# Altium project NGI_Search_StepDown.PrjPcb
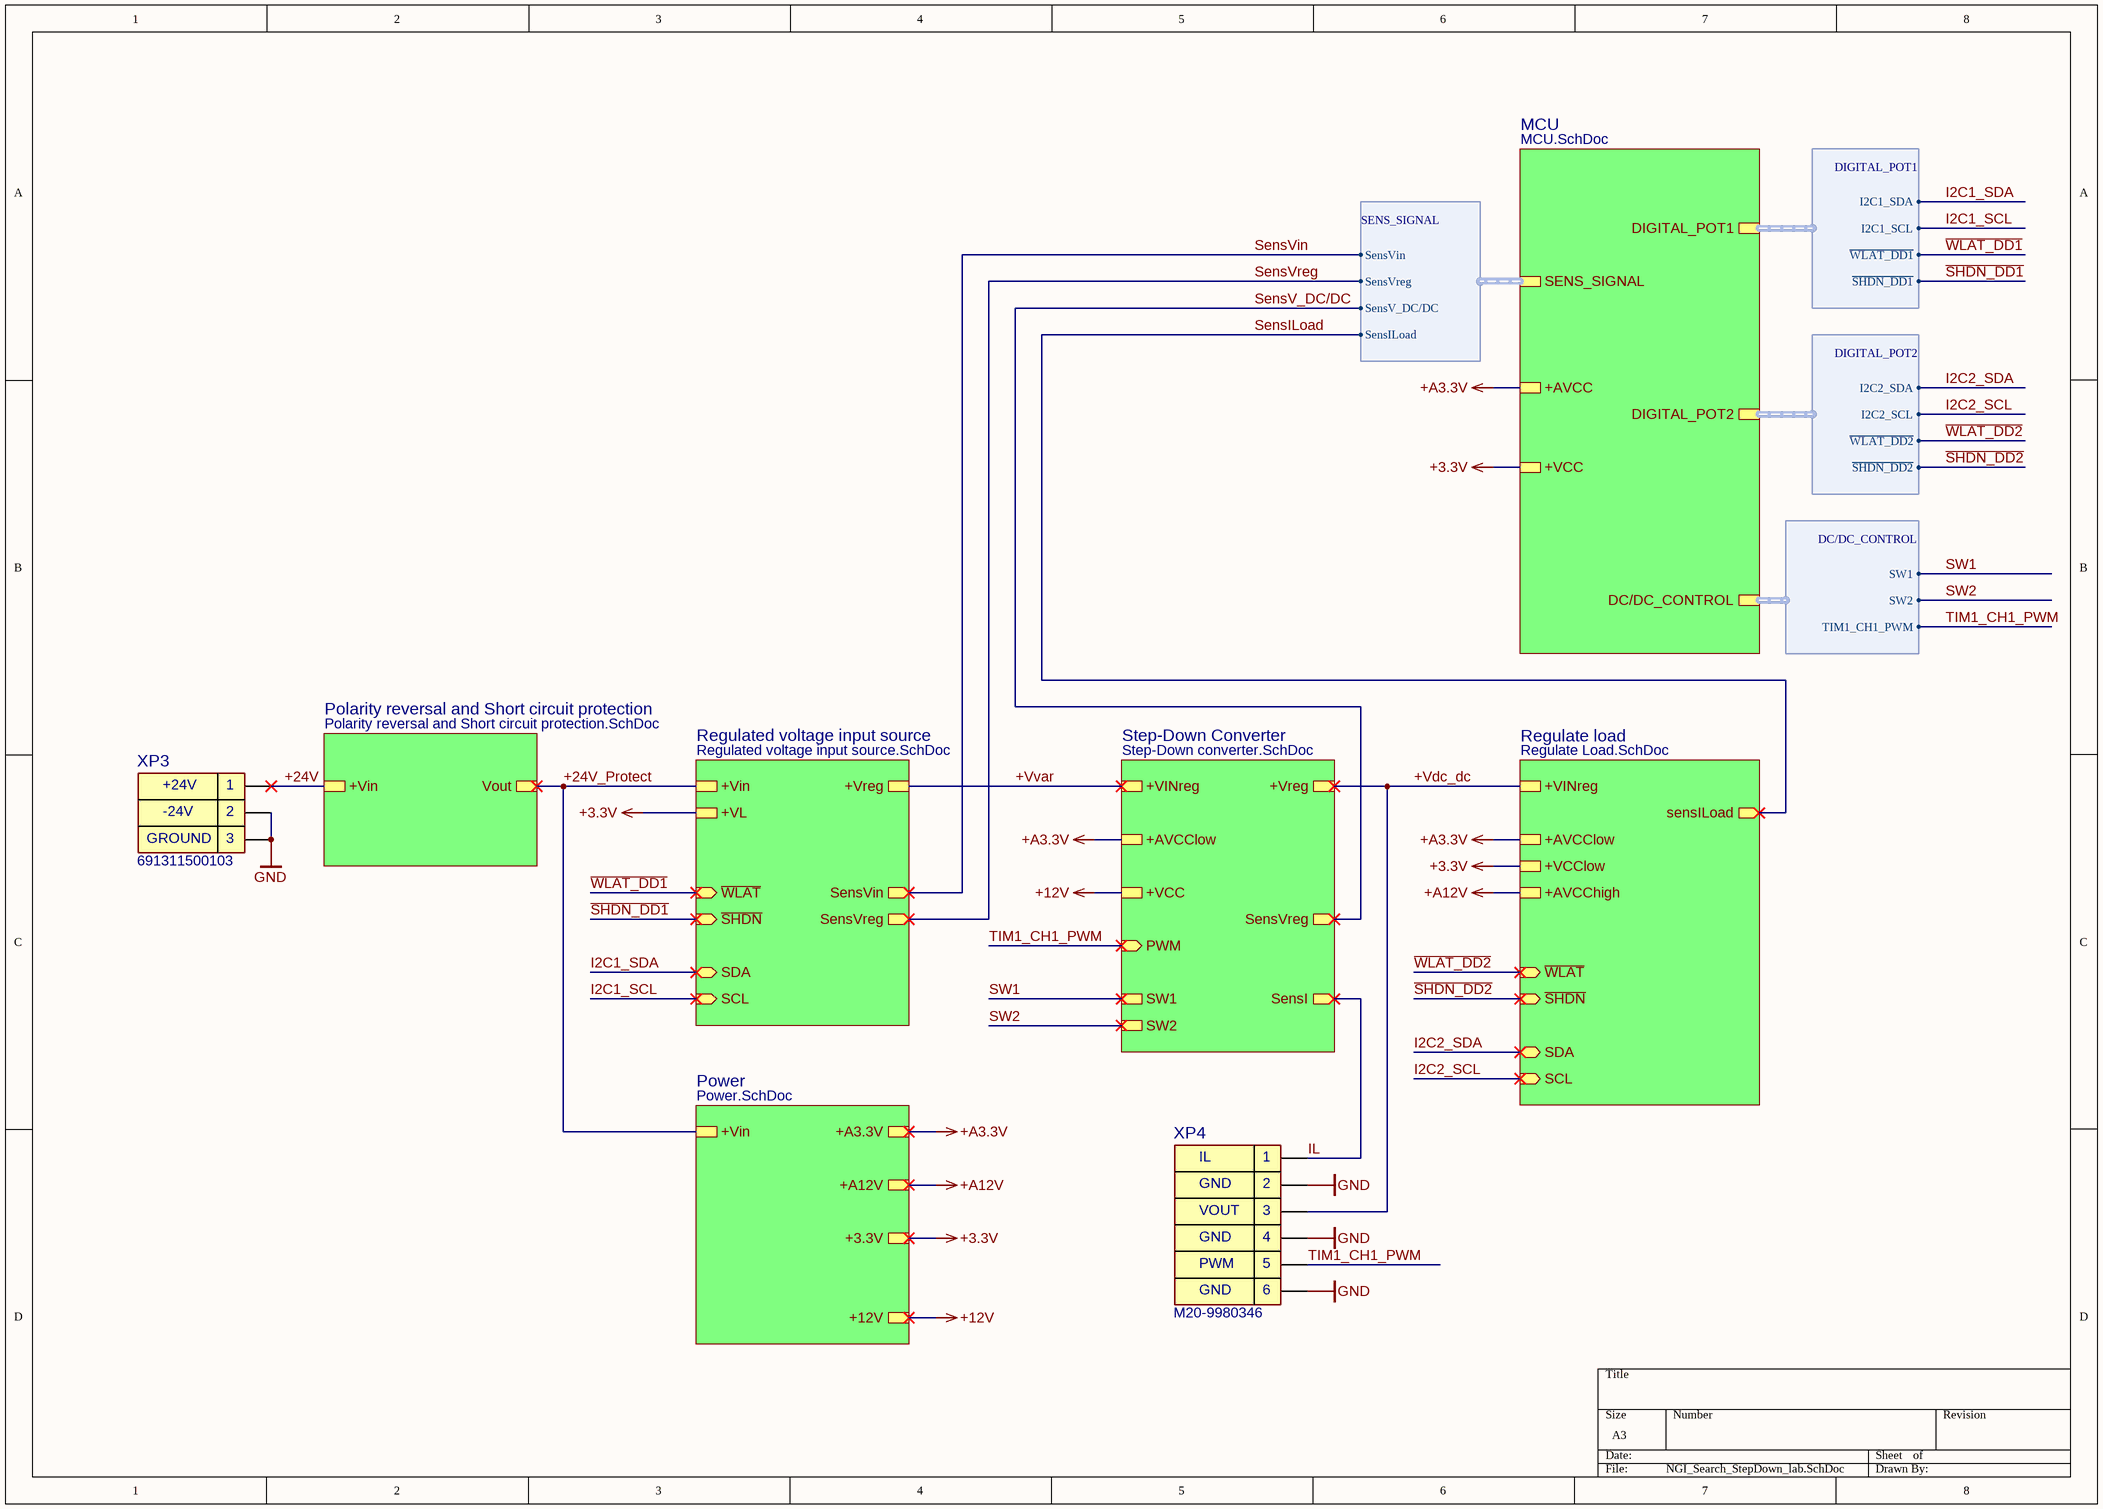
[diagram p0: NGI_Search_StepDown_lab.SchDoc]
5 sheets, 97 parts. Net scope: hierarchical (ports join the sheet entries above them; power ports are global).
Board file: NGIStepDownPCB.PcbDoc
Sheets:
  NGI_Search_StepDown_lab.SchDoc
    Step-Down Converter = Step-Down converter.SchDoc
    Regulated voltage input source = Regulated voltage input source.SchDoc
    Regulate load = Regulate Load.SchDoc
    Power = Power.SchDoc

## Sheet NGI_Search_StepDown_lab.SchDoc
size A3; SheetNumber: 1; SheetTotal: 7

### Parts
XP3  691311500103  [691311500103]
XP4  M20-9980346  [M20-9980346]

### Sub-sheets
MCU = MCU.SchDoc (file not in this document): DIGITAL_POT1 (harness DIGITAL_POT1), DIGITAL_POT2 (harness DIGITAL_POT2), DC/DC_CONTROL (harness DC/DC_CONTROL), SENS_SIGNAL (harness SENS_SIGNAL), +AVCC, +VCC
Polarity reversal and Short circuit protection = Polarity reversal and Short circuit protection.SchDoc (file not in this document): +Vin, Vout
Power = Power.SchDoc: +A12V, +A3.3V, +3.3V, +12V, +Vin
Regulate load = Regulate Load.SchDoc: +AVCClow, +VCClow, SCL (in), SDA (bidir), ~{WLAT} (in), ~{SHDN} (in), +AVCChigh, +VINreg, sensILoad (out)
Regulated voltage input source = Regulated voltage input source.SchDoc: +Vin, +Vreg, SCL (in), SDA (bidir), ~{WLAT} (in), ~{SHDN} (in), SensVin (out), SensVreg (out), +VL
Step-Down Converter = Step-Down converter.SchDoc: +VINreg, PWM (in), +VCC, +AVCClow, SensI (out), SW1, SW2, +Vreg, SensVreg (out)

### Harnesses
SENS_SIGNAL: SensVin, SensVreg, SensV_DC/DC, SensILoad
DIGITAL_POT1: I2C1_SDA, I2C1_SCL, ~{WLAT_DD1}, ~{SHDN_DD1}
DIGITAL_POT2: I2C2_SDA, I2C2_SCL, ~{WLAT_DD2}, ~{SHDN_DD2}
DC/DC_CONTROL: SW1, SW2, TIM1_CH1_PWM

### Nets
+3.3V: sheet Regulated voltage input source/+VL, sheet Regulate load/+VCClow, sheet Power/+3.3V, sheet MCU/+VCC
+12V: sheet Step-Down Converter/+VCC, sheet Power/+12V
+A3.3V: sheet Step-Down Converter/+AVCClow, sheet Regulate load/+AVCClow, sheet Power/+A3.3V, sheet MCU/+AVCC
+A12V: sheet Regulate load/+AVCChigh, sheet Power/+A12V
GND: XP3.2 XP3.3 XP4.2 XP4.4 XP4.6
+24V: XP3.1 ; sheet Polarity reversal and Short circuit protection/+Vin
+24V_Protect: sheet Regulated voltage input source/+Vin, sheet Power/+Vin, sheet Polarity reversal and Short circuit protection/Vout
+Vdc_dc: XP4.3 ; sheet Step-Down Converter/+Vreg, sheet Regulate load/+VINreg
+Vvar: sheet Step-Down Converter/+VINreg, sheet Regulated voltage input source/+Vreg
I2C1_SCL: sheet Regulated voltage input source/SCL, sheet MCU/DIGITAL_POT1.I2C1_SCL
I2C1_SDA: sheet Regulated voltage input source/SDA, sheet MCU/DIGITAL_POT1.I2C1_SDA
I2C2_SCL: sheet Regulate load/SCL, sheet MCU/DIGITAL_POT2.I2C2_SCL
I2C2_SDA: sheet Regulate load/SDA, sheet MCU/DIGITAL_POT2.I2C2_SDA
IL: XP4.1 ; sheet Step-Down Converter/SensI
~{SHDN_DD1}: sheet Regulated voltage input source/~{SHDN}, sheet MCU/DIGITAL_POT1.~{SHDN_DD1}
~{SHDN_DD2}: sheet Regulate load/~{SHDN}, sheet MCU/DIGITAL_POT2.~{SHDN_DD2}
SensILoad: sheet Regulate load/sensILoad, sheet MCU/SENS_SIGNAL.SensILoad
SensV_DC/DC: sheet Step-Down Converter/SensVreg, sheet MCU/SENS_SIGNAL.SensV_DC/DC
SensVin: sheet Regulated voltage input source/SensVin, sheet MCU/SENS_SIGNAL.SensVin
SensVreg: sheet Regulated voltage input source/SensVreg, sheet MCU/SENS_SIGNAL.SensVreg
SW1: sheet Step-Down Converter/SW1, sheet MCU/DC/DC_CONTROL.SW1
SW2: sheet Step-Down Converter/SW2, sheet MCU/DC/DC_CONTROL.SW2
TIM1_CH1_PWM: XP4.5 ; sheet Step-Down Converter/PWM, sheet MCU/DC/DC_CONTROL.TIM1_CH1_PWM
~{WLAT_DD1}: sheet Regulated voltage input source/~{WLAT}, sheet MCU/DIGITAL_POT1.~{WLAT_DD1}
~{WLAT_DD2}: sheet Regulate load/~{WLAT}, sheet MCU/DIGITAL_POT2.~{WLAT_DD2}

### Notes on the sheet
- (near XP3) +24V
- GROUND
- (near XP3) -24V
- IL
- GND
- (near XP4) VOUT
- PWM

### Library data of the parts
XP3 = 691311500103: Pluggable Terminal Blocks WR-TBL 300VAC 20A 3P Vertical; Manufacturer: Wurth Elektronik; Case: 3 VERTICAL PIN Pitch: 5.08 mm; Datasheet Link: https://www.we-online.com/components/products/datasheet/691311500103.pdf; ManufacturerPartNumber: 691311500103; Mouser Part Number: 710-691311500103; Mouser Price/Stock: https://eu.mouser.com/ProductDetail/Wurth-Elektronik/691311500103?qs=2kOmHSv6VfTr95JPv5RlIw%3D%3D
XP4 = M20-9980346: Headers & Wire Housings 03+03 DIL VERTICAL PIN HEADER TIN; Manufacturer: Harwin; Case: 03+03 DIL VERTICAL PIN; Datasheet Link: https://eu.mouser.com/datasheet/2/181/M20-998-1220570.pdf; ManufacturerPartNumber: M20-9980346; Mouser Part Number: 855-M20-9980346; Mouser Price/Stock: https://eu.mouser.com/ProductDetail/Harwin/M20-9980346?qs=%252Bk6%2F5FB6qrmHk2P20oz3FA%3D%3D

## Sheet Step-Down converter.SchDoc
size A3; SheetNumber: 3; SheetTotal: 7
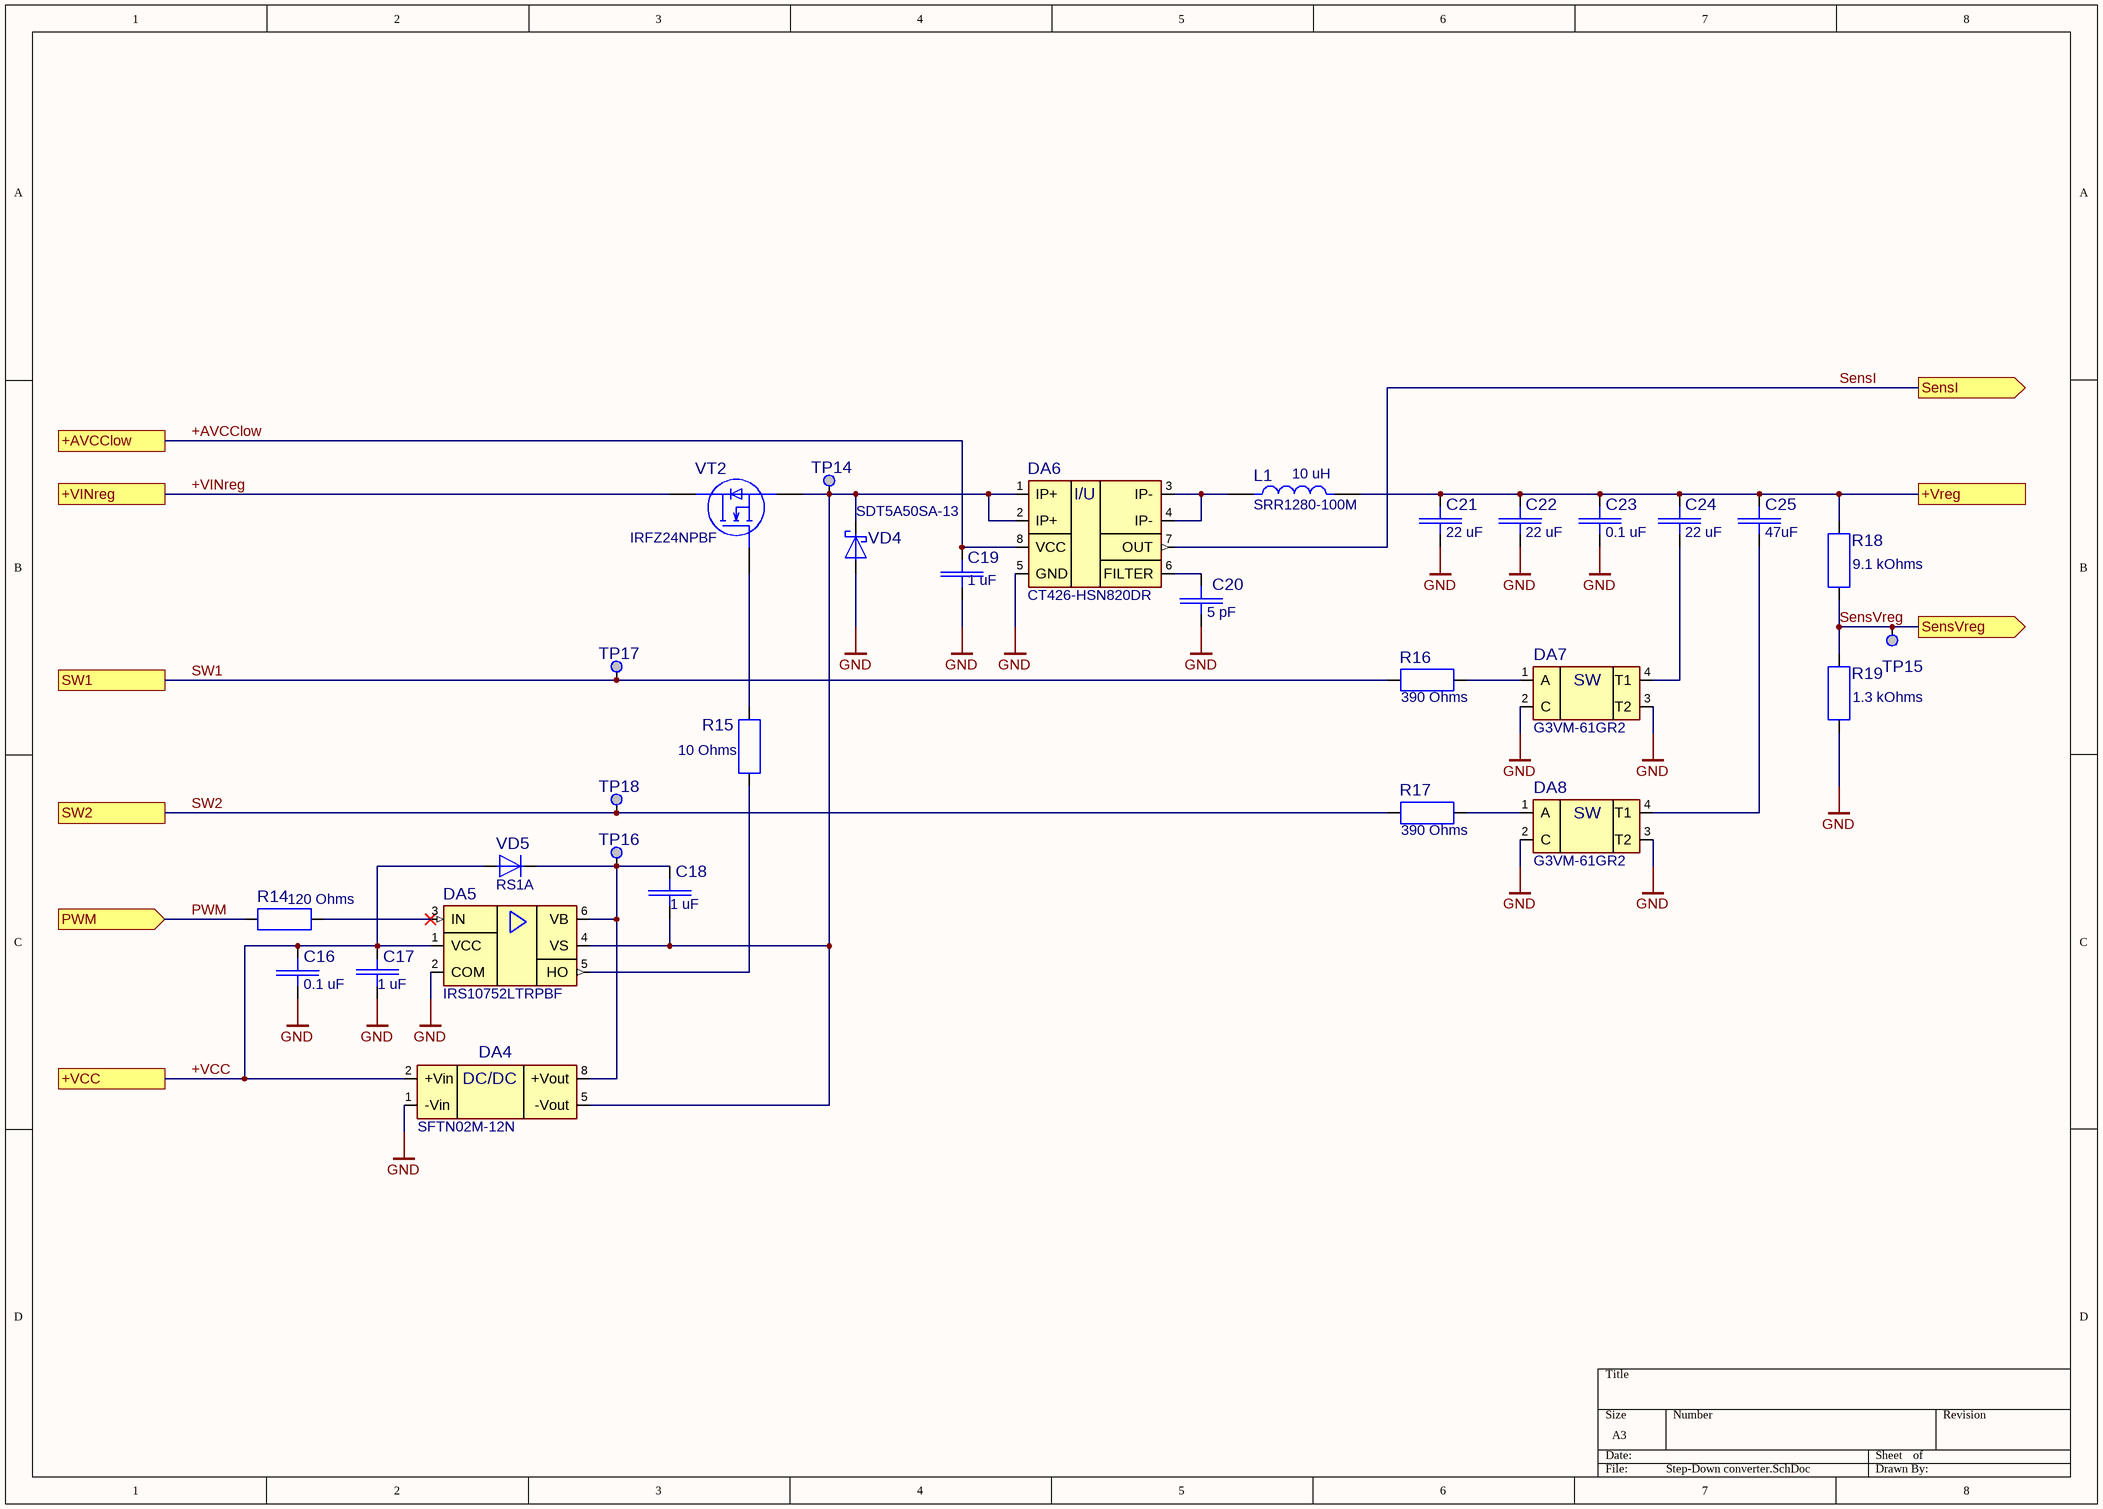
[diagram p1: Step-Down converter.SchDoc]

### Parts
C16  value 0.1 uF  [Capacitor0805_THICKNESS0.8]  (hidden comment: CL21B104KBCNNWC)
C17  value 1 uF  [Capacitor0805_THICKNESS1.25]  (hidden comment: CL21B105KAFNFNE)
C18  value 1 uF  [Capacitor0805_THICKNESS1.25]  (hidden comment: CL21B105KAFNFNE)
C19  value 1 uF  [Capacitor0805_THICKNESS1.25]  (hidden comment: CL21B105KAFNFNE)
C20  value 5 pF  [Capacitor0805_THICKNESS0.6]  (hidden comment: CC0805CRNPO9BN5R0)
C21  value 22 uF  [Capacitor1206_THICKNESS1.6]  (hidden comment: C3216X5R1V226M160AC)
C22  value 22 uF  [Capacitor1206_THICKNESS1.6]  (hidden comment: C3216X5R1V226M160AC)
C23  value 0.1 uF  [Capacitor0805_THICKNESS0.8]  (hidden comment: CL21B104KBCNNWC)
C24  value 22 uF  [Capacitor1206_THICKNESS1.6]  (hidden comment: C3216X5R1V226M160AC)
C25  value 47uF  [Capacitor2220_THICKNESS3.1]  (hidden comment: C5750X7R1V476M230KC)
DA4  SFTN02M-12N  [SFTN02-N]
DA5  IRS10752LTRPBF  [SOT23 6pin]
DA6  CT426-HSN820DR  [SOIC-8]
DA7  G3VM-61GR2  [SOP-4]
DA8  G3VM-61GR2  [SOP-4]
L1  SRR1280-100M  value 10 uH  [SRR1280-100M]
R14  value 120 Ohms  [Resistor0805_THICKNESS0.6]  (hidden comment: RC0805FR-07120RL)
R15  value 10 Ohms  [Resistor0805_THICKNESS0.6]  (hidden comment: RE0805FRE0710RL)
R16  value 390 Ohms  [Resistor0805_THICKNESS0.6]  (hidden comment: RC0805FR-07390RL)
R17  value 390 Ohms  [Resistor0805_THICKNESS0.6]  (hidden comment: RC0805FR-07390RL)
R18  value 9.1 kOhms  [Resistor0805_THICKNESS0.6]  (hidden comment: RC0805FR-079K1L)
R19  value 1.3 kOhms  [Resistor0805_THICKNESS0.6]  (hidden comment: RC0805FR-101K3L)
TP14  test point  [test point]  (value not drawn)
TP15  test point  [test point]  (value not drawn)
TP16  test point  [test point]  (value not drawn)
TP17  test point  [test point]  (value not drawn)
TP18  test point  [test point]  (value not drawn)
VD4  SDT5A50SA-13  [RS1A_CASE_SMA 403AE]
VD5  RS1A  [RS1A_CASE_SMA 403AE]
VT2  IRFZ24NPBF  [IRFZ24NPBF TO-220 with HS FA-T220-64E]

### Ports
+AVCClow (see NGI_Search2[4C], Regulate load2[1B]), +VCC (see NGI_Search2[4C]), +VINreg (see NGI_Search2[4C]), +Vreg (see NGI_Search2[5C]), PWM (in, see NGI_Search2[4C]), SensI (out, see NGI_Search2[5C]), SensVreg (out, see NGI_Search2[5C]), SW1 (see NGI_Search2[4C]), SW2 (see NGI_Search2[4C])

### Nets
+AVCClow: C19.2 DA6.8(VCC) ; port +AVCClow  [project net +A3.3V]
+VCC: C16.2 C17.1 DA4.2(+Vin) DA5.1(VCC) VD5.A ; port +VCC  [project net +12V]
GND: C16.1 C17.2 C19.1 C20.1 C21.1 C22.1 C23.1 DA4.1(-Vin) DA5.2(COM) DA6.5(GND) DA7.2(C) DA7.3(T2) DA8.2(C) DA8.3(T2) R19.1 VD4.A
+Vdc_dc: C21.2 C22.2 C23.2 C24.2 C25.2 L1.2 R18.2 ; port +Vreg
+VINreg: VT2.2(D) ; port +VINreg  [project net +Vvar]
PWM: R14.1 ; port PWM  [project net TIM1_CH1_PWM]
SensI: DA6.7(OUT) ; port SensI  [project net IL]
SensVreg: R18.1 R19.2 TP15.1 ; port SensVreg  [project net SensV_DC/DC]
SW1: R16.1 TP17.1 ; port SW1
SW2: R17.1 TP18.1 ; port SW2
NetC18_1: C18.1 DA4.5(-Vout) DA5.4(VS) DA6.1(IP+) DA6.2(IP+) TP14.1 VD4.C VT2.3(S)
NetC18_2: C18.2 DA4.8(+Vout) DA5.6(VB) TP16.1 VD5.C
NetC20_2: C20.2 DA6.6(FILTER)
NetC24_1: C24.1 DA7.4(T1)
NetC25_1: C25.1 DA8.4(T1)
NetDA5_3: DA5.3(IN) R14.2
NetDA5_5: DA5.5(HO) R15.1
NetDA6_3: DA6.3(IP-) DA6.4(IP-) L1.1
NetDA7_1: DA7.1(A) R16.2
NetDA8_1: DA8.1(A) R17.2
NetR15_2: R15.2 VT2.1(G)

Not connected (* = marked no-connect by the designer): DA4 3(N.C.) 6(N.C.) 7(N.C.) 10(N.C.) 11(N.C.) 12(N.C.)

### Notes on the sheet
- (in symbol CT426-HSN820DR) I/U
- (in symbol G3VM-61GR2) SW
- (in symbol SFTN02M-12N) DC/DC

### Library data of the parts
C16 C23 = CL21B104KBCNNWC: Multilayer Ceramic Capacitors MLCC - SMD/SMT 100nF+/-10% 50V X7R 0805; Manufacturer: Samsung Electro-Mechanics; Tolerance: 10%; Dielectric: X7R; ManufacturerPartNumber: CL21B104KBCNNWC; Mouser Price/Stock: https://eu.mouser.com/ProductDetail/Samsung-Electro-Mechanics/CL21B104KBCNNWC?qs=yOVawPpwOwlu2UTVxWhmlw%3D%3D; Power/Voltage: 50V; Case: 0805; Datasheet Link: https://eu.mouser.com/datasheet/2/585/MLCC-1837944.pdf; Mouser Part Number: 187-CL21B104KBCNNWC
C17-C19 = CL21B105KAFNFNE: Multilayer Ceramic Capacitors MLCC - SMD/SMT 1uF+/-10% 25V X7R 20 0805; Manufacturer: Samsung Electro-Mechanics; Tolerance: 10%; Case: 0805; Datasheet Link: https://eu.mouser.com/datasheet/2/585/MLCC-1837944.pdf; Dielectric: X7R; ManufacturerPartNumber: CL21B105KAFNFNE; Mouser Part Number: 187-CL21B105KAFNFNE; Mouser Price/Stock: https://eu.mouser.com/ProductDetail/Samsung-Electro-Mechanics/CL21B105KAFNFNE?qs=%252B6g0mu59x7LIqMOGGtEcpA%3D%3D; Power/Voltage: 25V
C20 = CC0805CRNPO9BN5R0: Multilayer Ceramic Capacitors MLCC - SMD/SMT 50V 5pF C0G 0805 Tol 0.25pF; Manufacturer: YAGEO; Dielectric: C0G (NP0); Tolerance: 5%; Case: 0805; Datasheet Link: https://eu.mouser.com/datasheet/2/447/UPY_NP0X5R_01005_4V_to_25V_V10-3003057.pdf; ManufacturerPartNumber: CC0805CRNPO9BN5R0; Mouser Part Number: 603-CC805CRNPO9BN5R0; Mouser Price/Stock: https://eu.mouser.com/ProductDetail/YAGEO/CC0805CRNPO9BN5R0?qs=57cj7OiSijm1o7wMqGKW1g%3D%3D; Power/Voltage: 50V
C21 C22 C24 = C3216X5R1V226M160AC: Multilayer Ceramic Capacitors MLCC - SMD/SMT 1206 35V 22uF X5R 20% T: 1.6mm; Manufacturer: TDK; Case: 1206; Datasheet Link: https://product.tdk.com/system/files/dam/doc/product/capacitor/ceramic/mlcc/catalog/mlcc_commercial_general_en.pdf; Dielectric: X5R; ManufacturerPartNumber: C3216X5R1V226M160AC; Mouser Part Number: 810-C3216X5R1V226M; Mouser Price/Stock: https://eu.mouser.com/ProductDetail/TDK/C3216X5R1V226M160AC?qs=NRhsANhppD8TwN31eZ1xGQ%3D%3D; Power/Voltage: 35V; Tolerance: 20%
C25 = C5750X7R1V476M230KC: Multilayer Ceramic Capacitors MLCC - SMD/SMT 2220 35VDC 47uF 20% X7R; Manufacturer: TDK; Power/Voltage: 35V; Case: 2220; Datasheet Link: https://product.tdk.com/system/files/dam/doc/product/capacitor/ceramic/mlcc/catalog/mlcc_commercial_general_en.pdf; Dielectric: X7R; ManufacturerPartNumber: C5750X7R1V476M230KC; Mouser Part Number: 810-C5750X7R1V476M23; Mouser Price/Stock: https://eu.mouser.com/ProductDetail/TDK/C5750X7R1V476M230KC?qs=rSMjJ%252B1ewcSIfs95ZgB3Sw%3D%3D; Tolerance: 20%
DA4 = SFTN02M-12N: Isolated DC/DC Converters - SMD 2W 12Vin 12Vout 33-167mA SMT Unregulated; Manufacturer: MEAN WELL; Case: SFTN02-N; Datasheet Link: https://www.meanwell.com/webapp/product/search.aspx?prod=SFTN02-N; ManufacturerPartNumber: SFTN02M-12N; Mouser Part Number: 709-SFTN02M-12N; Mouser Price/Stock: https://eu.mouser.com/ProductDetail/MEAN-WELL/SFTN02M-12N?qs=A6eO%252BMLsxmT1hTQp3VGaXQ%3D%3D
DA5 = IRS10752LTRPBF: Gate Drivers Hi Side Gate Driver Single Channel; Manufacturer: Infineon; Case: SOT-23 6pin; Datasheet Link: https://eu.mouser.com/datasheet/2/196/Infineon_IRS10752L_DS_v01_02_EN-3363637.pdf; ManufacturerPartNumber: IRS10752LTRPBF; Mouser Part Number: 942-IRS10752LTRPBF; Mouser Price/Stock: https://eu.mouser.com/ProductDetail/Infineon-Technologies/IRS10752LTRPBF?qs=17WaC%252BZOsuKXVNmF3l6MAw%3D%3D
DA6 = CT426-HSN820DR: Board Mount Current Sensors XtremeSense TMR Ultra-Low Noise, 8-lead SOIC (20 ADC; VDD = 3.3 V; Up to +125C); Manufacturer: Crocus Technology; Case: SOIC-8; Datasheet Link: https://eu.mouser.com/datasheet/2/779/CT426_Data_Sheet_Rev0_7-2934570.pdf; ManufacturerPartNumber: CT426-HSN820DR; Mouser Part Number: 462-CT426-HSN820DR; Mouser Price/Stock: https://eu.mouser.com/ProductDetail/Crocus/CT426-HSN820DR?qs=7D1LtPJG0i3u5AJ0mZ7fbw%3D%3D
DA7 DA8 = G3VM-61GR2: Solid State Relays - PCB Mount 60V,1.7A, 80mOhm ONr 1 Form A, SOP4/SMT; Manufacturer: Omron; Case: SOP-4; Datasheet Link: https://eu.mouser.com/datasheet/2/307/en-g3vm_61gr2-780127.pdf; ManufacturerPartNumber: G3VM-61GR2; Mouser Part Number: 653-G3VM61GR2; Mouser Price/Stock: https://eu.mouser.com/ProductDetail/Omron-Electronics/G3VM-61GR2?qs=ycOx5YLpuFVseArz%252BUpyOA%3D%3D
L1 = SRR1280-100M: Power Inductors - SMD 10uH 20% SMD 1280; Manufacturer: Bourns; Maximum Current: 6 A; Maximum Resistance: 19.5 mOhms; Case: 5050; Datasheet Link: https://eu.mouser.com/datasheet/2/54/srr1280-1391363.pdf; ManufacturerPartNumber: SRR1280-100M; Mouser Part Number: 652-SRR1280-100M; Mouser Price/Stock: https://eu.mouser.com/ProductDetail/Bourns/SRR1280-100M?qs=brMhP%2FMjUfe%2FtbNTKcGHiQ%3D%3D; Tolerance: 20%
R14 = RC0805FR-07120RL: Thick Film Resistors 120 Ohms 125 mW 0805 1%; Manufacturer: YAGEO; Power/Voltage: 125 mW / 150V; ManufacturerPartNumber: RC0805FR-07120RL; Tolerance: 1%; Case: 0805; Mouser Price/Stock: https://eu.mouser.com/ProductDetail/YAGEO/RC0805FR-07120RL?qs=sGAEpiMZZMvdGkrng054t8Tx25L%252BvTaRzcdZIgz1A9Y%3D; Datasheet Link: https://eu.mouser.com/datasheet/2/447/YAGEO_PYu_RC_Group_51_RoHS_L_12-3313492.pdf; Mouser Part Number: 603-RC0805FR-07120RL
R15 = RE0805FRE0710RL: Thick Film Resistors 10 Ohms 125 mW 0805 1%; Manufacturer: YAGEO; Power/Voltage: 125 mW / 150V; Case: 0805; Datasheet Link: https://eu.mouser.com/datasheet/2/447/PYu_RE_105_RoHS_L_6-3003059.pdf; ManufacturerPartNumber: RE0805FRE0710RL; Mouser Part Number: 603-RE0805FRE0710RL; Mouser Price/Stock: https://eu.mouser.com/ProductDetail/YAGEO/RE0805FRE0710RL?qs=sGAEpiMZZMvdGkrng054txKsa61JPVaKU6lpEP28x7tdTAAdaUzZLA%3D%3D; Tolerance: 1%
R16 R17 = RC0805FR-07390RL: Thick Film Resistors 390 Ohms 125 mW 0805 1%; Manufacturer: YAGEO; Power/Voltage: 125 mW / 150V; Case: 0805; Datasheet Link: https://eu.mouser.com/datasheet/2/447/YAGEO_PYu_RC_Group_51_RoHS_L_12-3313492.pdf; ManufacturerPartNumber: RC0805FR-07390RL; Mouser Part Number: 603-RC0805FR-07390RL; Mouser Price/Stock: https://eu.mouser.com/ProductDetail/YAGEO/RC0805FR-07390RL?qs=sGAEpiMZZMvdGkrng054txsj74Bdh5mga79f2h4RYlI%3D; Tolerance: 1%
R18 = RC0805FR-079K1L: Thick Film Resistors 9.1 kOhms 125 mW 0805 1%; Manufacturer: YAGEO; Power/Voltage: 125 mW / 150V; ManufacturerPartNumber: RC0805FR-079K1L; Tolerance: 1%; Case: 0805; Mouser Price/Stock: https://eu.mouser.com/ProductDetail/YAGEO/RC0805FR-079K1L?qs=sGAEpiMZZMvdGkrng054t8AJgcdMkx7xQsgCDGWWsX0%3D; Datasheet Link: https://eu.mouser.com/datasheet/2/447/YAGEO_PYu_RC_Group_51_RoHS_L_12-3313492.pdf; Mouser Part Number: 603-RC0805FR-079K1L
R19 = RC0805FR-101K3L: Thick Film Resistors 1.3 kOhms 250 mW 0805 1%; Manufacturer: YAGEO; Power/Voltage: 250 mW / 150V; ManufacturerPartNumber: RC0805FR-101K3; Tolerance: 1%; Case: 0805; Mouser Price/Stock: https://eu.mouser.com/ProductDetail/YAGEO/RC0805FR-101K3L?qs=sGAEpiMZZMvdGkrng054tyq4809kW%252ByTH4crGNSozBI%3D; Datasheet Link: https://eu.mouser.com/datasheet/2/447/PYu_RC_Group_51_RoHS_L_11-1984063.pdf; Mouser Part Number: 603-RC0805FR-101K3L
VD4 = SDT5A50SA-13: Schottky Diodes & Rectifiers Schottky Rectifier; Manufacturer: Diodes Incorporated; Case: SMA (DO-214AC); Datasheet Link: https://eu.mouser.com/datasheet/2/115/DIOD_S_A0006646692_1-2542970.pdf; ManufacturerPartNumber: SDT5A50SA-13; Mouser Part Number: 621-SDT5A50SA-13; Mouser Price/Stock: https://eu.mouser.com/ProductDetail/Diodes-Incorporated/SDT5A50SA-13?qs=PqoDHHvF648Tl3iEGgSrjg%3D%3D
VD5 = RS1A: Rectifiers 50V 1a Fast Rect SMa; Manufacturer: onsemi; ManufacturerPartNumber: RS1A; Mouser Price/Stock: https://eu.mouser.com/ProductDetail/onsemi-Fairchild/RS1A?qs=sGAEpiMZZMutXGli8Ay4kAXd892%252BOdvfjQsX8ptTDkM%3D; Case: SMA 403AE; Datasheet Link: https://eu.mouser.com/datasheet/2/308/1/RS1M_D-2320127.pdf; Mouser Part Number: 512-RS1A
VT2 = IRFZ24NPBF: MOSFT 55V 17A 70mOhm 13.3nC; Manufacturer: Infineon; Case: TO-220; Datasheet Link: https://eu.mouser.com/datasheet/2/196/Infineon_IRFZ24N_DataSheet_v01_01_EN-3363353.pdf; ManufacturerPartNumber: IRFZ24NPBF; Mouser Part Number: 942-IRFZ24NPBF; Mouser Price/Stock: https://eu.mouser.com/ProductDetail/Infineon-Technologies/IRFZ24NPBF?qs=9%252BKlkBgLFf0TQgSTtY4J0g%3D%3D

## Sheet Regulated voltage input source.SchDoc
size A3; SheetNumber: 2; SheetTotal: 7
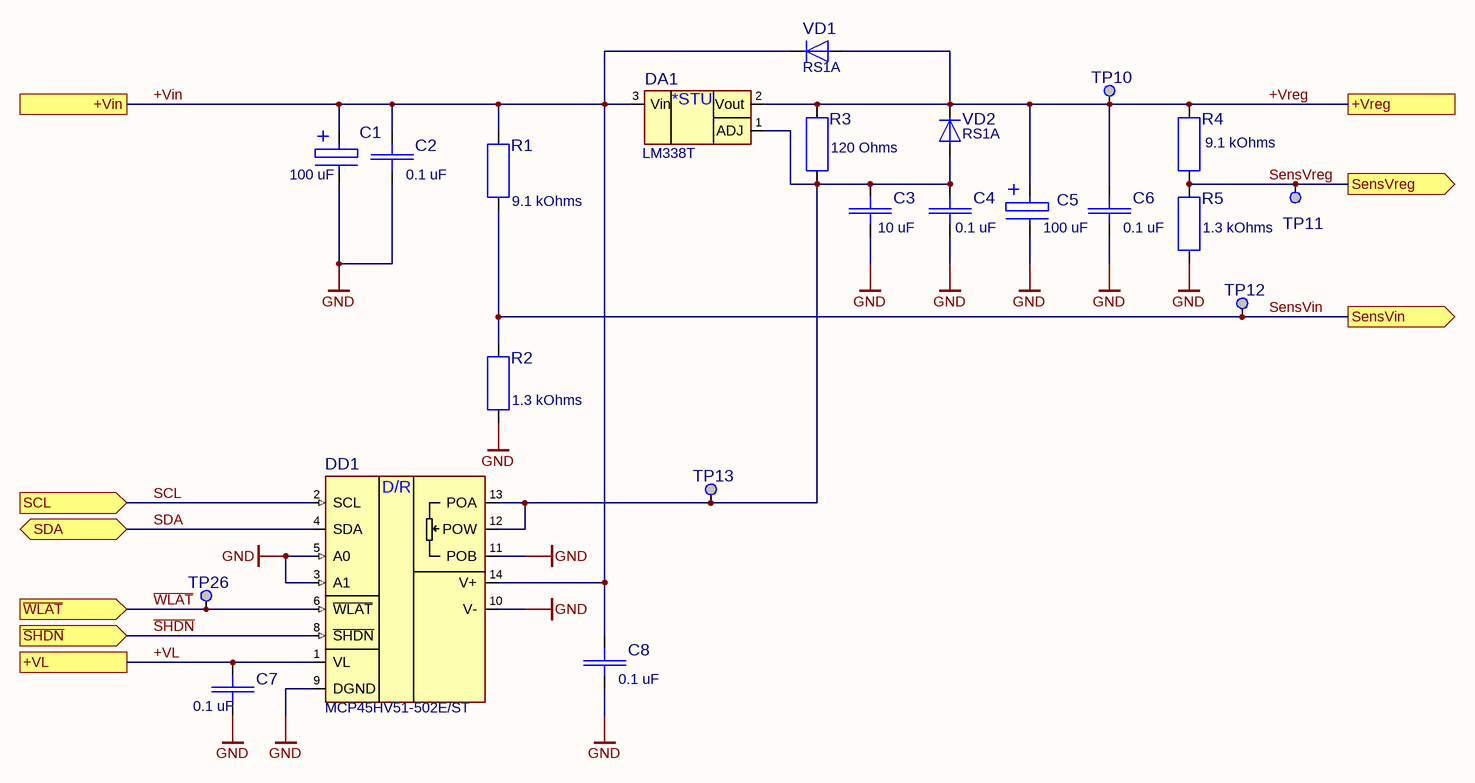
[diagram p2: Regulated voltage input source.SchDoc]

### Parts
C1  value 100 uF  [EEH-ZA1V101P]  (hidden comment: EEH-ZA1V101P)
C2  value 0.1 uF  [Capacitor0805_THICKNESS0.8]  (hidden comment: CL21B104KBCNNWC)
C3  value 10 uF  [Capacitor0805_THICKNESS1.45]  (hidden comment: GRM21BR6YA106KE43K)
C4  value 0.1 uF  [Capacitor0805_THICKNESS0.8]  (hidden comment: CL21B104KBCNNWC)
C5  value 100 uF  [EEH-ZA1V101P]  (hidden comment: EEH-ZA1V101P)
C6  value 0.1 uF  [Capacitor0805_THICKNESS0.8]  (hidden comment: CL21B104KBCNNWC)
C7  value 0.1 uF  [Capacitor0805_THICKNESS0.8]  (hidden comment: CL21B104KBCNNWC)
C8  value 0.1 uF  [Capacitor0805_THICKNESS0.8]  (hidden comment: CL21B104KBCNNWC)
DA1  LM338T  [LM338T TO-220 with HS FA-T220-64E]
DD1  MCP45HV51-502E/ST  [TSOP-14]
R1  value 9.1 kOhms  [Resistor0805_THICKNESS0.6]  (hidden comment: RC0805FR-079K1L)
R2  value 1.3 kOhms  [Resistor0805_THICKNESS0.6]  (hidden comment: RC0805FR-101K3L)
R3  value 120 Ohms  [Resistor0805_THICKNESS0.6]  (hidden comment: RC0805FR-07120RL)
R4  value 9.1 kOhms  [Resistor0805_THICKNESS0.6]  (hidden comment: RC0805FR-079K1L)
R5  value 1.3 kOhms  [Resistor0805_THICKNESS0.6]  (hidden comment: RC0805FR-101K3L)
TP10  test point  [test point]  (value not drawn)
TP11  test point  [test point]  (value not drawn)
TP12  test point  [test point]  (value not drawn)
TP13  test point  [test point]  (value not drawn)
TP26  test point  [test point]  (value not drawn)
VD1  RS1A  [RS1A_CASE_SMA 403AE]
VD2  RS1A  [RS1A_CASE_SMA 403AE]

### Ports
+Vin (see NGI_Search2[2C], power2[1B]), +VL (see NGI_Search2[2C]), +Vreg (see NGI_Search2[2C]), SCL (in, see NGI_Search2[2C]), SDA (bidir, see NGI_Search2[2C]), SensVin (out, see NGI_Search2[2C]), SensVreg (out, see NGI_Search2[2C]), ~{SHDN} (in, see NGI_Search2[2C]), ~{WLAT} (in, see NGI_Search2[2C])

### Nets
+VL: C7.2 DD1.1(VL) ; port +VL  [project net +3.3V]
GND: C1.2 C2.2 C3.1 C4.1 C5.2 C6.1 C7.1 C8.1 DD1.3(A1) DD1.5(A0) DD1.9(DGND) DD1.10(V-) DD1.11(POB) R2.2 R5.2
+Vin: C1.1 C2.1 C8.2 DA1.3(Vin) DD1.14(V+) R1.1 VD1.C ; port +Vin  [project net +24V_Protect]
+Vreg: C5.1 C6.2 DA1.2(Vout) R3.2 R4.1 TP10.1 VD1.A VD2.C ; port +Vreg  [project net +Vvar]
~{SHDN}: DD1.8(~{SHDN}) ; port ~{SHDN}  [project net ~{SHDN_DD1}]
SCL: DD1.2(SCL) ; port SCL  [project net I2C1_SCL]
SDA: DD1.4(SDA) ; port SDA  [project net I2C1_SDA]
SensVin: R1.2 R2.1 TP12.1 ; port SensVin
SensVreg: R4.2 R5.1 TP11.1 ; port SensVreg
~{WLAT}: DD1.6(~{WLAT}) TP26.1 ; port ~{WLAT}  [project net ~{WLAT_DD1}]
NetC3_2: C3.2 C4.2 DA1.1(ADJ) DD1.12(POW) DD1.13(POA) R3.1 TP13.1 VD2.A

Not connected (* = marked no-connect by the designer): DD1 7(NC)

### Notes on the sheet
- (in symbol LM338T) *STU
- (in symbol MCP45HV51-502E/ST) D/R

### Library data of the parts
C1 C5 = EEH-ZA1V101P: Aluminium Organic Polymer Capacitors 35VDC 100uF 20% AEC-Q200; Manufacturer: Panasonic; Power/Voltage: 35V; ESR: 27 mOhms; ManufacturerPartNumber: EEH-ZA1V101P; Tolerance: 20%; Mouser Price/Stock: https://eu.mouser.com/ProductDetail/Panasonic/EEH-ZA1V101P?qs=sGAEpiMZZMvwFf0viD3Y3a3yb5D6sPUgQ6Q%252BT2xzDvzCb9%252BaM%252B4sJw%3D%3D; Case: G; Datasheet Link: https://eu.mouser.com/datasheet/2/315/ABA0000C1221-1280637.pdf; Mouser Part Number: 667-EEH-ZA1V101P
C2 C4 C6-C8 = CL21B104KBCNNWC: as C16 on sheet Step-Down converter; Dielectric: X7R; ManufacturerPartNumber: CL21B104KBCNNWC; Mouser Price/Stock: https://eu.mouser.com/ProductDetail/Samsung-Electro-Mechanics/CL21B104KBCNNWC?qs=yOVawPpwOwlu2UTVxWhmlw%3D%3D; Power/Voltage: 50V; Case: 0805; Datasheet Link: https://eu.mouser.com/datasheet/2/585/MLCC-1837944.pdf; Mouser Part Number: 187-CL21B104KBCNNWC
C3 = GRM21BR6YA106KE43K: Multilayer Ceramic Capacitors MLCC - SMD/SMT 10 uF 35 VDC 10% 0805 X5R; Manufacturer: Murata; Power/Voltage: 35V; Tolerance: 10%; Dielectric: X5R; ManufacturerPartNumber: GRM21BR6YA106KE43K; Mouser Price/Stock: https://eu.mouser.com/ProductDetail/Murata-Electronics/GRM21BR6YA106KE43K?qs=QzBtWTOodeW8NrklCAafzg%3D%3D; Case: 0805; Datasheet Link: https://eu.mouser.com/datasheet/2/281/1/GRM21BR6YA106KE43_01A-1986981.pdf; Mouser Part Number: 81-GRM21BR6YA106KE3K
DA1 = LM338T: Linear Voltage Regulators 5 AMP ADJUSTABLE REG; Manufacturer: Texas Instruments; ManufacturerPartNumber: LM338T; Mouser Price/Stock: https://eu.mouser.com/ProductDetail/Texas-Instruments/LM338T-NOPB?qs=X1J7HmVL2ZENaH7%2FMvkSlw%3D%3D; Case: TO-220; Datasheet Link: https://www.ti.com/lit/ds/symlink/lm138.pdf?ts=1704385927498&ref_url=https%253A%252F%252Feu.mouser.com%252F; Mouser Part Number: 926-LM338T/NOPB
DD1 = MCP45HV51-502E/ST: Digital Potentiometer ICs 8-bit, vol Digi Pot 5K ohm, 14ld TSSOP; Manufacturer: Microchip; ManufacturerPartNumber: MCP45HV51-502E/ST; Mouser Price/Stock: https://eu.mouser.com/ProductDetail/Microchip-Technology/MCP45HV51-502E-ST?qs=wzzOUr4NhYo51RHFtIUWQw%3D%3D; Case: TSSOP-14; Datasheet Link: https://eu.mouser.com/datasheet/2/268/MCP45HVX1_Data_Sheet_DS20005304-3224813.pdf; Mouser Part Number: 579-MCP45HV51-502EST
R1 R4 = RC0805FR-079K1L: as R18 on sheet Step-Down converter; ManufacturerPartNumber: RC0805FR-079K1L; Tolerance: 1%; Case: 0805; Mouser Price/Stock: https://eu.mouser.com/ProductDetail/YAGEO/RC0805FR-079K1L?qs=sGAEpiMZZMvdGkrng054t8AJgcdMkx7xQsgCDGWWsX0%3D; Datasheet Link: https://eu.mouser.com/datasheet/2/447/YAGEO_PYu_RC_Group_51_RoHS_L_12-3313492.pdf; Mouser Part Number: 603-RC0805FR-079K1L
R2 R5 = RC0805FR-101K3L: as R19 on sheet Step-Down converter; ManufacturerPartNumber: RC0805FR-101K3; Tolerance: 1%; Case: 0805; Mouser Price/Stock: https://eu.mouser.com/ProductDetail/YAGEO/RC0805FR-101K3L?qs=sGAEpiMZZMvdGkrng054tyq4809kW%252ByTH4crGNSozBI%3D; Datasheet Link: https://eu.mouser.com/datasheet/2/447/PYu_RC_Group_51_RoHS_L_11-1984063.pdf; Mouser Part Number: 603-RC0805FR-101K3L
R3 = RC0805FR-07120RL: as R14 on sheet Step-Down converter; ManufacturerPartNumber: RC0805FR-07120RL; Tolerance: 1%; Case: 0805; Mouser Price/Stock: https://eu.mouser.com/ProductDetail/YAGEO/RC0805FR-07120RL?qs=sGAEpiMZZMvdGkrng054t8Tx25L%252BvTaRzcdZIgz1A9Y%3D; Datasheet Link: https://eu.mouser.com/datasheet/2/447/YAGEO_PYu_RC_Group_51_RoHS_L_12-3313492.pdf; Mouser Part Number: 603-RC0805FR-07120RL
VD1 VD2 = RS1A: as VD5 on sheet Step-Down converter; ManufacturerPartNumber: RS1A; Mouser Price/Stock: https://eu.mouser.com/ProductDetail/onsemi-Fairchild/RS1A?qs=sGAEpiMZZMutXGli8Ay4kAXd892%252BOdvfjQsX8ptTDkM%3D; Case: SMA 403AE; Datasheet Link: https://eu.mouser.com/datasheet/2/308/1/RS1M_D-2320127.pdf; Mouser Part Number: 512-RS1A

## Sheet Regulate Load.SchDoc
size A3; SheetNumber: 4; SheetTotal: 7
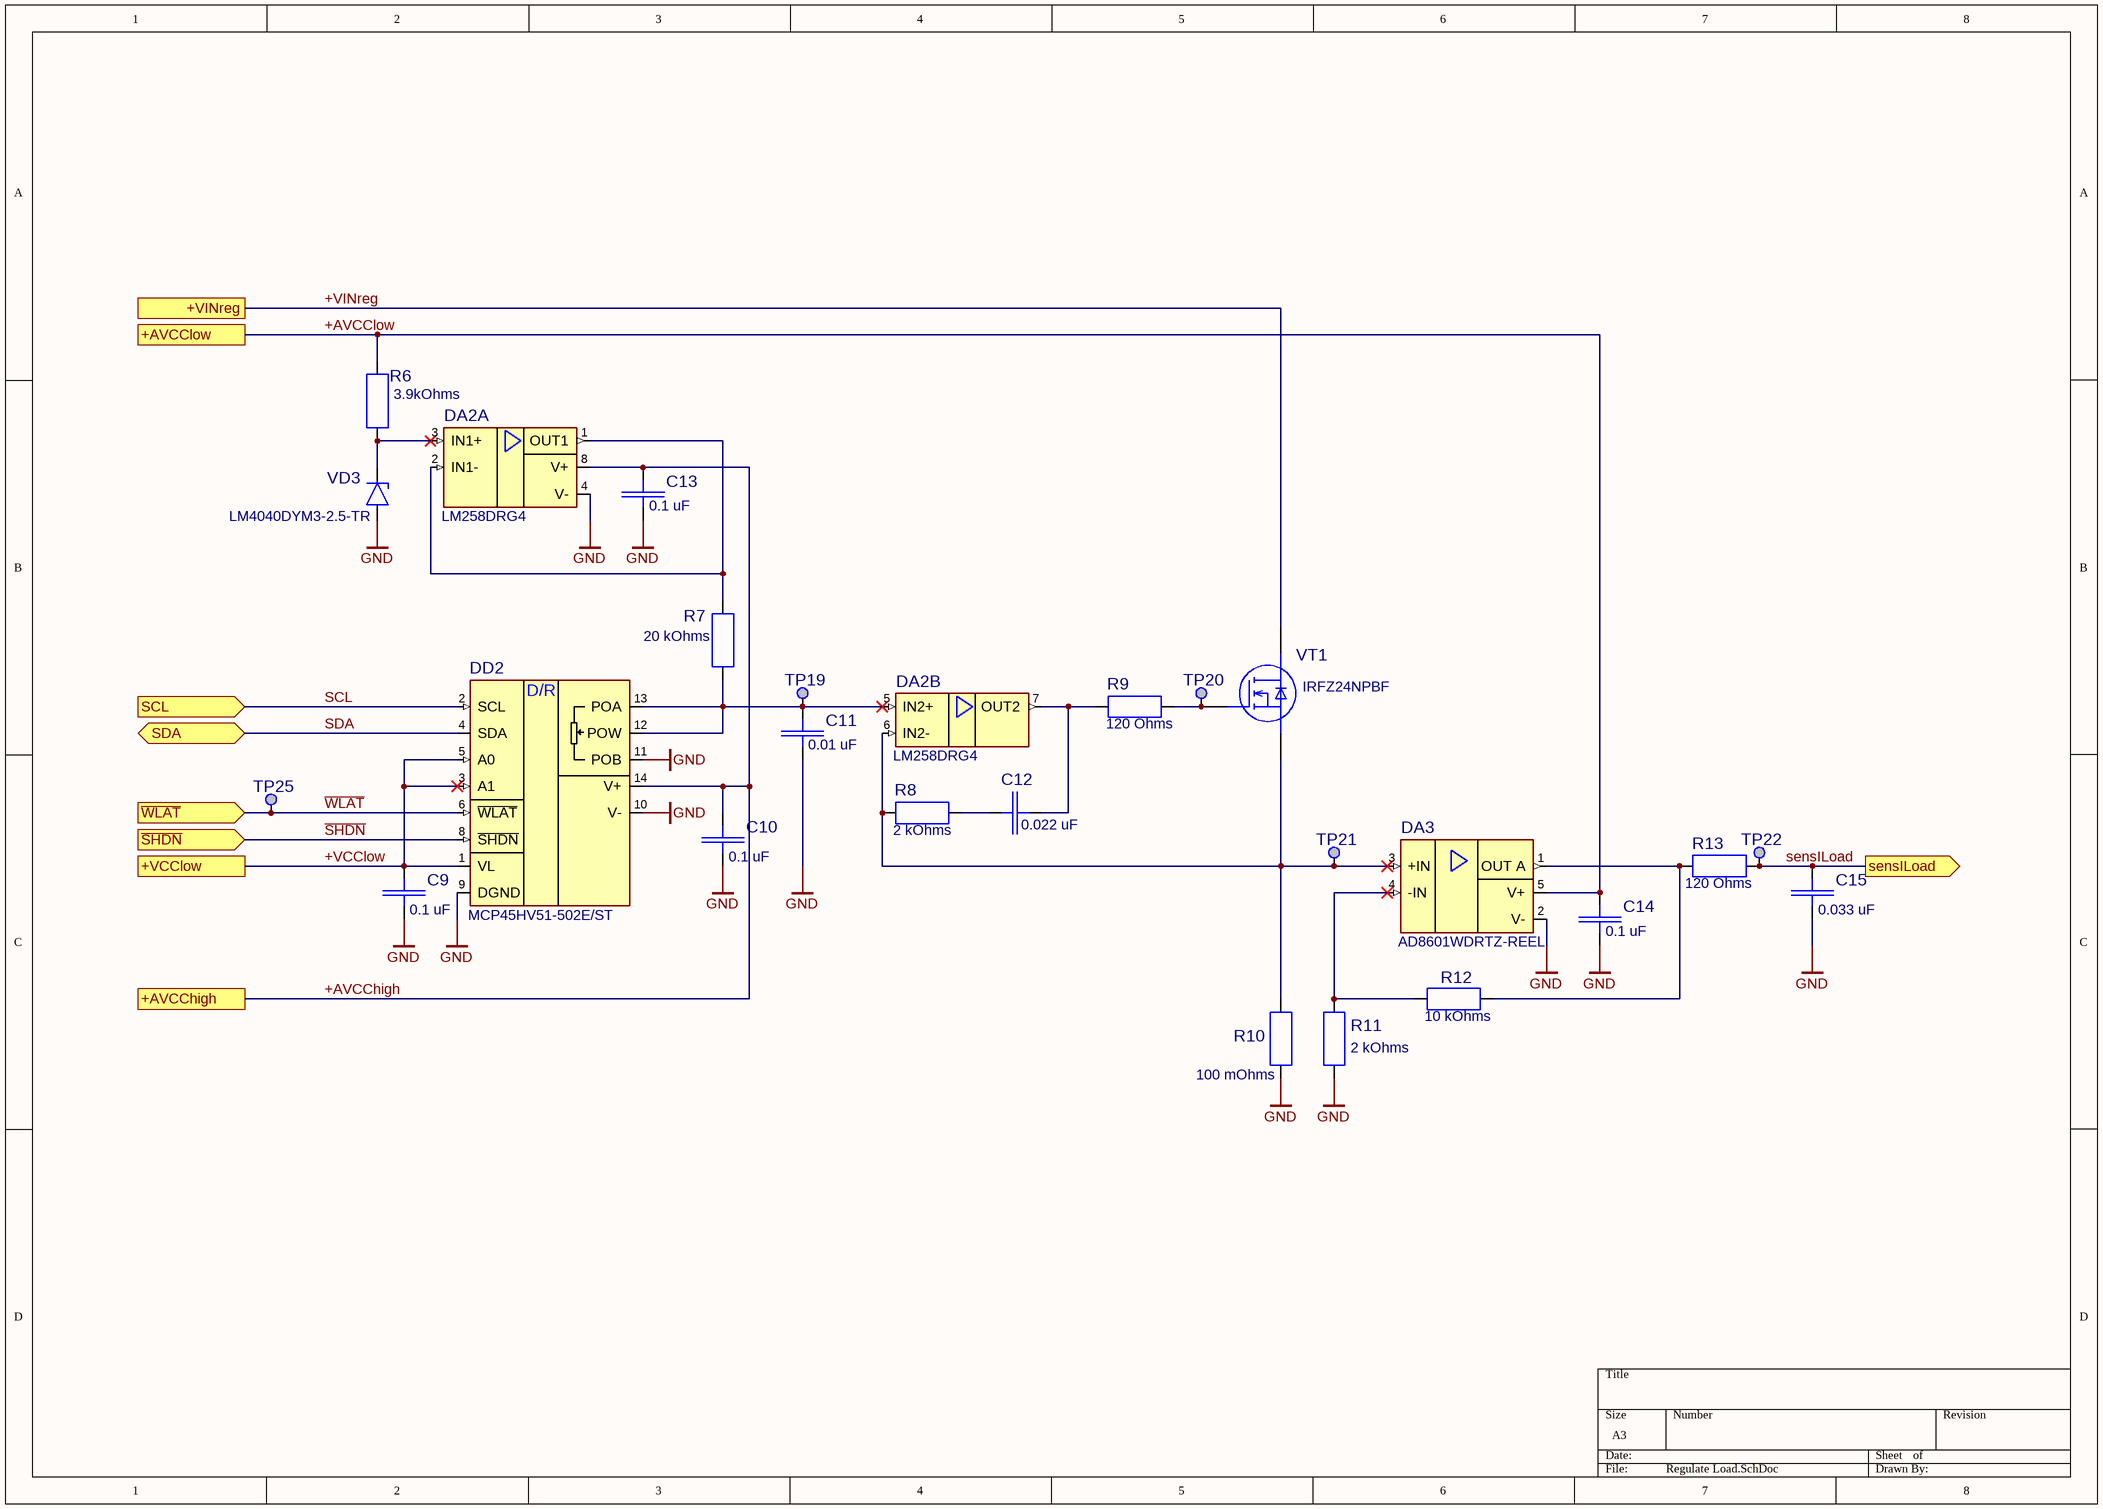
[diagram p3: Regulate Load.SchDoc]

### Parts
C9  value 0.1 uF  [Capacitor0805_THICKNESS0.8]  (hidden comment: CL21B104KBCNNWC)
C10  value 0.1 uF  [Capacitor0805_THICKNESS0.8]  (hidden comment: CL21B104KBCNNWC)
C11  value 0.01 uF  [Capacitor0805_THICKNESS0.8]  (hidden comment: CL21B103KBANNNL)
C12  value 0.022 uF  [Capacitor0805_THICKNESS0.8]  (hidden comment: CL21B223KBANNND)
C13  value 0.1 uF  [Capacitor0805_THICKNESS0.8]  (hidden comment: CL21B104KBCNNWC)
C14  value 0.1 uF  [Capacitor0805_THICKNESS0.8]  (hidden comment: CL21B104KBCNNWC)
C15  value 0.033 uF  [Capacitor0805_THICKNESS0.8]  (hidden comment: C0805C333K5RAC)
DA2  LM258DRG4  [SOIC-8]  (parts A,B of 2)
DA3  AD8601WDRTZ-REEL  [SOT-23 5pin]
DD2  MCP45HV51-502E/ST  [TSOP-14]
R6  value 3.9kOhms  [Resistor0805_THICKNESS0.6]  (hidden comment: RC0805FR-103K9L)
R7  value 20 kOhms  [Resistor0805_THICKNESS0.6]  (hidden comment: RC0805FR-1020KL)
R8  value 2 kOhms  [Resistor0805_THICKNESS0.6]  (hidden comment: RC0805FR-072KL)
R9  value 120 Ohms  [Resistor0805_THICKNESS0.6]  (hidden comment: RC0805FR-07120RL)
R10  value 100 mOhms  [Resistor2512_THICKNESS_0.9]  (hidden comment: CRA2512-FZ-R100ELF)
R11  value 2 kOhms  [Resistor0805_THICKNESS0.6]  (hidden comment: RC0805FR-072KL)
R12  value 10 kOhms  [Resistor0805_THICKNESS0.6]  (hidden comment: RC0805FR-0710KL)
R13  value 120 Ohms  [Resistor0805_THICKNESS0.6]  (hidden comment: RC0805FR-07120RL)
TP19  test point  [test point]  (value not drawn)
TP20  test point  [test point]  (value not drawn)
TP21  test point  [test point]  (value not drawn)
TP22  test point  [test point]  (value not drawn)
TP25  test point  [test point]  (value not drawn)
VD3  LM4040DYM3-2.5-TR  [SOT23 3pin]
VT1  IRFZ24NPBF  [IRFZ24NPBF TO-220 with HS FA-T220-64E]

### Ports
+AVCChigh (see NGI_Search2[6C]), +AVCClow (see NGI_Search2[6C], Step-Down converter2[1A]), +VCClow (see NGI_Search2[6C]), +VINreg (see NGI_Search2[6C]), SCL (in, see NGI_Search2[6C]), SDA (bidir, see NGI_Search2[6C]), sensILoad (out, see NGI_Search2[7C]), ~{SHDN} (in, see NGI_Search2[6C]), ~{WLAT} (in, see NGI_Search2[6C])

### Nets
+AVCChigh: C10.2 C13.2 DA2.8(V+) DD2.14(V+) ; port +AVCChigh  [project net +A12V]
+AVCClow: C14.2 DA3.5(V+) R6.2 ; port +AVCClow  [project net +A3.3V]
+VCClow: C9.2 DD2.1(VL) DD2.3(A1) DD2.5(A0) ; port +VCClow  [project net +3.3V]
GND: C9.1 C10.1 C11.1 C13.1 C14.1 C15.1 DA2.4(V-) DA3.2(V-) DD2.9(DGND) DD2.10(V-) DD2.11(POB) R10.1 R11.2 VD3.1(+)
+VINreg: VT1.2(D) ; port +VINreg  [project net +Vdc_dc]
~{SHDN}: DD2.8(~{SHDN}) ; port ~{SHDN}  [project net ~{SHDN_DD2}]
SCL: DD2.2(SCL) ; port SCL  [project net I2C2_SCL]
SDA: DD2.4(SDA) ; port SDA  [project net I2C2_SDA]
SensILoad: C15.2 R13.2 TP22.1 ; port sensILoad
~{WLAT}: DD2.6(~{WLAT}) TP25.1 ; port ~{WLAT}  [project net ~{WLAT_DD2}]
NetC11_2: C11.2 DA2.5(IN2+) DD2.12(POW) DD2.13(POA) R7.1 TP19.1
NetC12_1: C12.1 R8.2
NetC12_2: C12.2 DA2.7(OUT2) R9.1
NetDA2_1: DA2.1(OUT1) DA2.2(IN1-) R7.2
NetDA2_3: DA2.3(IN1+) R6.1 VD3.2(-)
NetDA2_6: DA2.6(IN2-) DA3.3(+IN) R8.1 R10.2 TP21.1 VT1.3(S)
NetDA3_1: DA3.1(OUT_A) R12.2 R13.1
NetDA3_4: DA3.4(-IN) R11.1 R12.1
NetR9_2: R9.2 TP20.1 VT1.1(G)

Not connected (* = marked no-connect by the designer): DD2 7(NC); VD3 3(NC)

### Notes on the sheet
- (in symbol MCP45HV51-502E/ST) D/R

### Library data of the parts
C9 C10 C13 C14 = CL21B104KBCNNWC: as C16 on sheet Step-Down converter; Dielectric: X7R; ManufacturerPartNumber: CL21B104KBCNNWC; Mouser Price/Stock: https://eu.mouser.com/ProductDetail/Samsung-Electro-Mechanics/CL21B104KBCNNWC?qs=yOVawPpwOwlu2UTVxWhmlw%3D%3D; Power/Voltage: 50V; Case: 0805; Datasheet Link: https://eu.mouser.com/datasheet/2/585/MLCC-1837944.pdf; Mouser Part Number: 187-CL21B104KBCNNWC
C11 = CL21B103KBANNNL: Multilayer Ceramic Capacitors MLCC - SMD/SMT 10nF+/-10% 50V X7R 2 0805; Manufacturer: Samsung Electro-Mechanics; Tolerance: 10%; Case: 0805; Datasheet Link: https://eu.mouser.com/datasheet/2/585/MLCC-1837944.pdf; Dielectric: X7R; ManufacturerPartNumber: CL21B103KBANNNL; Mouser Part Number: 187-CL21B103KBANNNL; Mouser Price/Stock: https://eu.mouser.com/ProductDetail/Samsung-Electro-Mechanics/CL21B103KBANNNL?qs=sGAEpiMZZMvsSlwiRhF8qtsGU%2FCnaNeQUbGZYi74bLm5gwqVLR8V4A%3D%3D; Power/Voltage: 50V
C12 = CL21B223KBANNND: Multilayer Ceramic Capacitors MLCC - SMD/SMT 22nF+/-10% 50V X7R 2 0805; Manufacturer: Samsung Electro-Mechanics; Tolerance: 10%; Case: 0805; Datasheet Link: https://eu.mouser.com/datasheet/2/585/MLCC-1837944.pdf; Dielectric: X7R; ManufacturerPartNumber: CL21B223KBANNND; Mouser Part Number: 187-CL21B223KBANNND; Mouser Price/Stock: https://eu.mouser.com/ProductDetail/Samsung-Electro-Mechanics/CL21B223KBANNND?qs=sGAEpiMZZMvsSlwiRhF8qlxW52pIu5FNS13PGP1GZqY%3D; Power/Voltage: 50V
C15 = C0805C333K5RAC: Multilayer Ceramic Capacitors MLCC - SMD/SMT 50V 0.033uF X7R 0805 10%; Manufacturer: KEMET; Case: 0805; Datasheet Link: https://eu.mouser.com/datasheet/2/447/KEM_C1002_X7R_SMD-3316098.pdf; Dielectric: X7R; ManufacturerPartNumber: C0805C333K5RAC; Mouser Part Number: 80-C0805C333K5RAC; Mouser Price/Stock: https://eu.mouser.com/ProductDetail/KEMET/C0805C333K5RAC?qs=sGAEpiMZZMvsSlwiRhF8qtpM02mjhsWZUP8GnSbnH5w%3D; Power/Voltage: 50V; Tolerance: 10%
DA2 = LM258DRG4: Operational Amplifiers - Op Amps Dual Operational Amplifier; Manufacturer: Texas Instruments; Case: SOIC-8; Datasheet Link: https://www.ti.com/lit/ds/symlink/lm2904ba.pdf?ts=1704458867193&ref_url=https%253A%252F%252Fwww.mouser.com.tr%252F; ManufacturerPartNumber: LM258DRG4; Mouser Price/Stock: https://eu.mouser.com/ProductDetail/Texas-Instruments/LM258DRG4?qs=VBduBm9rCJSSuHFL4rPBDA%3D%3D; Mouser Part Number: 595-LM258DRG4
DA3 = AD8601WDRTZ-REEL: Precision Amplifiers Single, Lw Cst, 8MHz, RRIO, 5V OpAmp; Manufacturer: Analog Devices Inc.; Case: SOT-23 5pin; Datasheet Link: https://eu.mouser.com/datasheet/2/609/ad8601_8602_8604-3119459.pdf; ManufacturerPartNumber: AD8601WDRTZ-REEL; Mouser Part Number: 584-AD8601WDRTZ-R; Mouser Price/Stock: https://eu.mouser.com/ProductDetail/Analog-Devices/AD8601WDRTZ-REEL?qs=%2FtpEQrCGXCxTn38zRtQA5Q%3D%3D
DD2 = MCP45HV51-502E/ST: as DD1 on sheet Regulated voltage input source; ManufacturerPartNumber: MCP45HV51-502E/ST; Mouser Price/Stock: https://eu.mouser.com/ProductDetail/Microchip-Technology/MCP45HV51-502E-ST?qs=wzzOUr4NhYo51RHFtIUWQw%3D%3D; Case: TSSOP-14; Datasheet Link: https://eu.mouser.com/datasheet/2/268/MCP45HVX1_Data_Sheet_DS20005304-3224813.pdf; Mouser Part Number: 579-MCP45HV51-502EST
R6 = RC0805FR-103K9L: Thick Film Resistors 3.9kOhms 1/8W 0805 1%; Manufacturer: YAGEO; Power/Voltage: 125 mW / 150V; Case: 0805; Datasheet Link: https://eu.mouser.com/datasheet/2/447/PYu_RC_Group_51_RoHS_L_11-1984063.pdf; ManufacturerPartNumber: RC0805FR-103K9L; Mouser Part Number: 603-RC0805FR-103K9L; Mouser Price/Stock: https://eu.mouser.com/ProductDetail/YAGEO/RC0805FR-103K9L?qs=sGAEpiMZZMvdGkrng054t8AJgcdMkx7xNu5h6kkjzWs%3D; Tolerance: 1%
R7 = RC0805FR-1020KL: Thick Film Resistors 20 kOhms 125 mW 0805 1%; Manufacturer: YAGEO; Power/Voltage: 125 mW / 150V; Case: 0805; Datasheet Link: https://eu.mouser.com/datasheet/2/447/PYu_RC_Group_51_RoHS_L_11-1984063.pdf; ManufacturerPartNumber: RC0805FR-1020KL; Mouser Part Number: 603-RC0805FR-1020KL; Mouser Price/Stock: https://eu.mouser.com/ProductDetail/YAGEO/RC0805FR-1020KL?qs=sGAEpiMZZMvdGkrng054t7z4BkURc4LzyQBLWrMO%252BznK%2FJbWTd%2FqOQ%3D%3D; Tolerance: 1%
R8 R11 = RC0805FR-072KL: Thick Film Resistors 2 kOhms 125 mW 0805 1%; Manufacturer: YAGEO; Power/Voltage: 125 mW / 150V; Case: 0805; Datasheet Link: https://eu.mouser.com/datasheet/2/447/YAGEO_PYu_RC_Group_51_RoHS_L_12-3313492.pdf; ManufacturerPartNumber: RC0805FR-072KL; Mouser Part Number: 603-RC0805FR-072KL; Mouser Price/Stock: https://eu.mouser.com/ProductDetail/YAGEO/RC0805FR-072KL?qs=sGAEpiMZZMvdGkrng054t8Tx25L%252BvTaRvd4yrUANrI8%3D; Tolerance: 1%
R9 R13 = RC0805FR-07120RL: as R14 on sheet Step-Down converter; ManufacturerPartNumber: RC0805FR-07120RL; Tolerance: 1%; Case: 0805; Mouser Price/Stock: https://eu.mouser.com/ProductDetail/YAGEO/RC0805FR-07120RL?qs=sGAEpiMZZMvdGkrng054t8Tx25L%252BvTaRzcdZIgz1A9Y%3D; Datasheet Link: https://eu.mouser.com/datasheet/2/447/YAGEO_PYu_RC_Group_51_RoHS_L_12-3313492.pdf; Mouser Part Number: 603-RC0805FR-07120RL
R10 = CRA2512-FZ-R100ELF: Current Sense Resistors 0.100ohms 1% +/- 50PPM; Manufacturer: Bourns; Power/Voltage: 3 W; Case: 2512; Datasheet Link: https://eu.mouser.com/datasheet/2/54/cra-1862173.pdf; ManufacturerPartNumber: CRA2512-FZ-R100ELF; Mouser Part Number: 652-CRA2512FZR100ELF; Mouser Price/Stock: https://eu.mouser.com/ProductDetail/Bourns/CRA2512-FZ-R100ELF?qs=sGAEpiMZZMvdGkrng054t219Tlw6YGVDJEjBibzyJuk%3D; Tolerance: 1%
R12 = RC0805FR-0710KL: Thick Film Resistors 10 kOhms 125 mW 0805 1%; Manufacturer: YAGEO; Power/Voltage: 125 mW / 150V; Case: 0805; Datasheet Link: https://eu.mouser.com/datasheet/2/447/YAGEO_PYu_RC_Group_51_RoHS_L_12-3313492.pdf; ManufacturerPartNumber: RC0805FR-0710KL; Mouser Part Number: 603-RC0805FR-0710KL; Mouser Price/Stock: https://eu.mouser.com/ProductDetail/YAGEO/RC0805FR-0710KL?qs=sGAEpiMZZMvdGkrng054txdMlaQGj9fi4uZGpN02qIo%3D; Tolerance: 1%
VD3 = LM4040DYM3-2.5-TR: Voltage References Shunt Voltage Reference, 2.5V, 1.0% Accuracy, 150ppm/deg; Manufacturer: Microchip; Case: SOT-23 3pin; Datasheet Link: https://eu.mouser.com/datasheet/2/268/LM4040_41_Precision_Micropower_Shunt_Voltage_Refer-1890894.pdf; ManufacturerPartNumber: LM4040DYM3-2.5-TR; Mouser Part Number: 998-LM4040DYM3-2.5TR; Mouser Price/Stock: https://eu.mouser.com/ProductDetail/Microchip-Technology/LM4040DYM3-2.5-TR?qs=Y3Q3JoKAO1S64N4CecjyLw%3D%3D
VT1 = IRFZ24NPBF: as VT2 on sheet Step-Down converter; Case: TO-220; Datasheet Link: https://eu.mouser.com/datasheet/2/196/Infineon_IRFZ24N_DataSheet_v01_01_EN-3363353.pdf; ManufacturerPartNumber: IRFZ24NPBF; Mouser Part Number: 942-IRFZ24NPBF; Mouser Price/Stock: https://eu.mouser.com/ProductDetail/Infineon-Technologies/IRFZ24NPBF?qs=9%252BKlkBgLFf0TQgSTtY4J0g%3D%3D

## Sheet Power.SchDoc
size A3; SheetNumber: 5; SheetTotal: 7
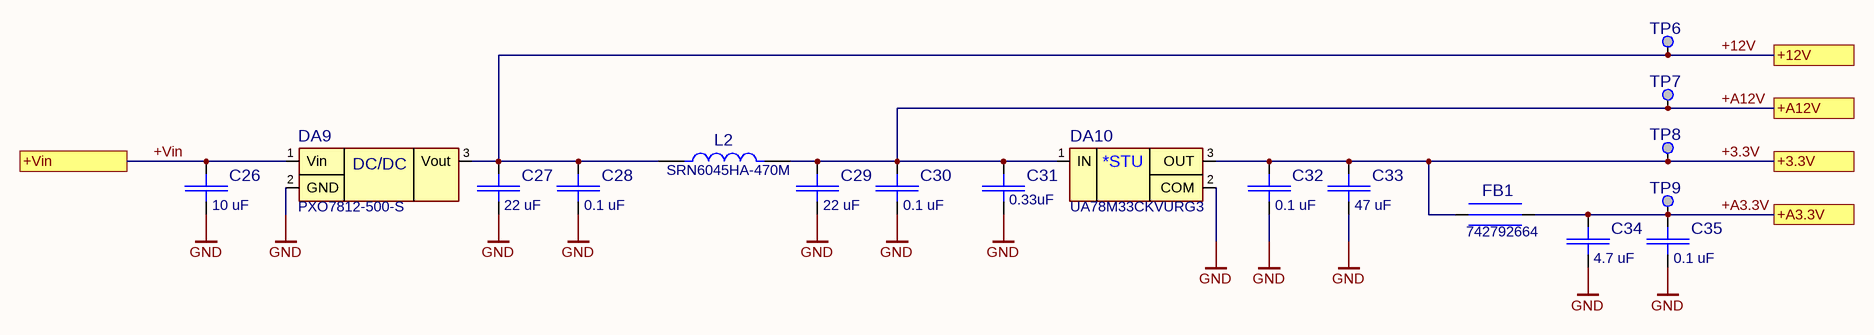
[diagram p4: Power.SchDoc]

### Parts
C26  value 10 uF  [Capacitor0805_THICKNESS1.45]  (hidden comment: GRM21BR6YA106KE43K)
C27  value 22 uF  [Capacitor1206_THICKNESS1.6]  (hidden comment: C3216X5R1V226M160AC)
C28  value 0.1 uF  [Capacitor0805_THICKNESS0.8]  (hidden comment: CL21B104KBCNNWC)
C29  value 22 uF  [Capacitor1206_THICKNESS1.6]  (hidden comment: C3216X5R1V226M160AC)
C30  value 0.1 uF  [Capacitor0805_THICKNESS0.8]  (hidden comment: CL21B104KBCNNWC)
C31  value 0.33uF  [Capacitor0805_THICKNESS1.25]  (hidden comment: CC0805KKX7R8BB334)
C32  value 0.1 uF  [Capacitor0805_THICKNESS0.8]  (hidden comment: CL21B104KBCNNWC)
C33  value 47 uF  [Capacitor0805_THICKNESS1.25]  (hidden comment: GRM21BR61A476ME15K)
C34  value 4.7 uF  [Capacitor0805_THICKNESS1.25]  (hidden comment: CL21A475KAQNNNF)
C35  value 0.1 uF  [Capacitor0805_THICKNESS0.8]  (hidden comment: CL21B104KBCNNWC)
DA9  PXO7812-500-S  [PXO7812-500-S_POSITIVEOUTPUT]
DA10  UA78M33CKVURG3  [TO-252 3pin THICKNESS2.52]
FB1  742792664  [742792664_Ferrite Beads_0603]
L2  SRN6045HA-470M  [SRN6045HA-470M]
TP6  test point  [test point]  (value not drawn)
TP7  test point  [test point]  (value not drawn)
TP8  test point  [test point]  (value not drawn)
TP9  test point  [test point]  (value not drawn)

### Ports
+3.3V (see NGI_Search2[2D]), +12V (see NGI_Search2[2D]), +A3.3V (see NGI_Search2[2D]), +A12V (see NGI_Search2[2D]), +Vin (see NGI_Search2[2D], Regulated voltage input source2[1B])

### Nets
+3.3V: C32.2 C33.2 DA10.3(OUT) FB1.1 TP8.1 ; port +3.3V
+12V: C27.2 C28.2 DA9.3(Vout) L2.1 TP6.1 ; port +12V
+A3.3V: C34.2 C35.2 FB1.2 TP9.1 ; port +A3.3V
+A12V: C29.2 C30.2 C31.2 DA10.1(IN) L2.2 TP7.1 ; port +A12V
GND: C26.1 C27.1 C28.1 C29.1 C30.1 C31.1 C32.1 C33.1 C34.1 C35.1 DA9.2(GND) DA10.2(COM)
+Vin: C26.2 DA9.1(Vin) ; port +Vin  [project net +24V_Protect]

### Notes on the sheet
- (in symbol PXO7812-500-S) DC/DC
- (in symbol UA78M33CKVURG3) *STU

### Library data of the parts
C26 = GRM21BR6YA106KE43K: as C3 on sheet Regulated voltage input source; Tolerance: 10%; Dielectric: X5R; ManufacturerPartNumber: GRM21BR6YA106KE43K; Mouser Price/Stock: https://eu.mouser.com/ProductDetail/Murata-Electronics/GRM21BR6YA106KE43K?qs=QzBtWTOodeW8NrklCAafzg%3D%3D; Case: 0805; Datasheet Link: https://eu.mouser.com/datasheet/2/281/1/GRM21BR6YA106KE43_01A-1986981.pdf; Mouser Part Number: 81-GRM21BR6YA106KE3K
C27 C29 = C3216X5R1V226M160AC: as C21 on sheet Step-Down converter; Case: 1206; Datasheet Link: https://product.tdk.com/system/files/dam/doc/product/capacitor/ceramic/mlcc/catalog/mlcc_commercial_general_en.pdf; Dielectric: X5R; ManufacturerPartNumber: C3216X5R1V226M160AC; Mouser Part Number: 810-C3216X5R1V226M; Mouser Price/Stock: https://eu.mouser.com/ProductDetail/TDK/C3216X5R1V226M160AC?qs=NRhsANhppD8TwN31eZ1xGQ%3D%3D; Power/Voltage: 35V; Tolerance: 20%
C28 C30 C32 C35 = CL21B104KBCNNWC: as C16 on sheet Step-Down converter; Dielectric: X7R; ManufacturerPartNumber: CL21B104KBCNNWC; Mouser Price/Stock: https://eu.mouser.com/ProductDetail/Samsung-Electro-Mechanics/CL21B104KBCNNWC?qs=yOVawPpwOwlu2UTVxWhmlw%3D%3D; Power/Voltage: 50V; Case: 0805; Datasheet Link: https://eu.mouser.com/datasheet/2/585/MLCC-1837944.pdf; Mouser Part Number: 187-CL21B104KBCNNWC
C31 = CC0805KKX7R8BB334: Multilayer Ceramic Capacitors MLCC - SMD/SMT 25V 0.33uF X7R 0805 10%; Manufacturer: YAGEO; Case: 0805; Datasheet Link: https://eu.mouser.com/datasheet/2/447/UPY_GPHC_X7R_6_3V_to_250V_23-3084653.pdf; Dielectric: X7R; ManufacturerPartNumber: CC0805KKX7R8BB334; Mouser Part Number: 603-CC805KKX7R8BB334; Mouser Price/Stock: https://eu.mouser.com/ProductDetail/YAGEO/CC0805KKX7R8BB334?qs=sGAEpiMZZMvsSlwiRhF8qhv%252BGHtcCd98Tol7cGM2QGw%3D; Power/Voltage: 25V; Tolerance: 10%
C33 = GRM21BR61A476ME15K: Multilayer Ceramic Capacitors MLCC - SMD/SMT 47 uF 10 VDC 20% 0805 X5R; Manufacturer: Murata; Power/Voltage: 10V; Case: 0805; Datasheet Link: https://eu.mouser.com/datasheet/2/281/1/GRM21BR61A476ME15_01A-1986931.pdf; Dielectric: X5R; ManufacturerPartNumber: GRM21BR61A476ME15K; Mouser Part Number: 81-GRM21BR61A476ME5K; Mouser Price/Stock: https://eu.mouser.com/ProductDetail/Murata-Electronics/GRM21BR61A476ME15K?qs=sGAEpiMZZMvsSlwiRhF8qtKev7nvVKumdokzOmlxZZTbnZpuci0nOw%3D%3D; Tolerance: 20%
C34 = CL21A475KAQNNNF: Multilayer Ceramic Capacitors MLCC - SMD/SMT 4.7uF+/-10% 25V X5R 0805; Manufacturer: Samsung Electro-Mechanics; Tolerance: 10%; Case: 0805; Datasheet Link: https://eu.mouser.com/datasheet/2/585/MLCC-1837944.pdf; Dielectric: X5R; ManufacturerPartNumber: CL21A475KAQNNNF; Mouser Part Number: 187-CL21A475KAQNNNF; Mouser Price/Stock: https://eu.mouser.com/ProductDetail/Samsung-Electro-Mechanics/CL21A475KAQNNNF?qs=sGAEpiMZZMvsSlwiRhF8qtsGU%2FCnaNeQ9%2FtqxdEQLsBh1lK0%252BjEvRQ%3D%3D; Power/Voltage: 25V
DA9 = PXO7812-500-S: Non-Isolated DC/DC Converters dc-dc non-isolated, 0.5 A, 15-36 Vdc input, 12 Vdc output, SIP; Manufacturer: CUI Inc.; Case: POSITIVEOUTPUT; Datasheet Link: https://eu.mouser.com/datasheet/2/670/pxo78_500_s-3313217.pdf; ManufacturerPartNumber: PXO7812-500-S; Mouser Part Number: 490-PXO7812-500-S; Mouser Price/Stock: https://eu.mouser.com/ProductDetail/CUI-Inc/PXO7812-500-S?qs=Y0Uzf4wQF3kdbacxg4U5TQ%3D%3D
DA10 = UA78M33CKVURG3: Linear Voltage Regulators 3.3 V 500mA Fix Pos Voltage Regulator; Manufacturer: Texas Instruments; Case: TO-252 3pin; Datasheet Link: https://www.ti.com/lit/ds/symlink/ua78m.pdf?ts=1704830544530&ref_url=https%253A%252F%252Fwww.mouser.ch%252F; ManufacturerPartNumber: UA78M33CKVURG3; Mouser Part Number: 595-UA78M33CKVURG3; Mouser Price/Stock: https://eu.mouser.com/ProductDetail/Texas-Instruments/UA78M33CKVURG3?qs=0O%2FZFlpUpJXrDg4gfD1Q2g%3D%3D
FB1 = 742792664: Ferrite Beads WE-CBF 0603 100MHz 1000Ohm 300mA AEC-Q200; Manufacturer: Wurth Elektronik; Case: 0603; Datasheet Link: https://www.we-online.com/components/products/datasheet/742792664.pdf; ManufacturerPartNumber: 742792664; Maximum Current: 300 mA; Mouser Part Number: 710-742792664; Mouser Price/Stock: https://eu.mouser.com/ProductDetail/Wurth-Elektronik/742792664?qs=5twSNpOB8ICHwt6lnbKGWQ%3D%3D; Value: 1000Ohm; Frequency: 100 MHz
L2 = SRN6045HA-470M: Power Inductors - SMD Ind,6x6x4.7mm,47uH+/-20%,1A,semi-shd; Manufacturer: Bourns; Maximum Resistance: 305 mOhms; Tolerance: 20%; Value: 47 uH; Case: R55; Datasheet Link: https://eu.mouser.com/datasheet/2/54/SRN6045HA_datasheet-2498144.pdf; ManufacturerPartNumber: SRN6045HA-470M; Maximum Current: 1 A; Mouser Part Number: 652-SRN6045HA-470M; Mouser Price/Stock: https://eu.mouser.com/ProductDetail/Bourns/SRN6045HA-470M?qs=e8oIoAS2J1TQqJ%2FyaON1CQ%3D%3D

## Nets that join several sheets
+3.3V: Regulated voltage input source (C7.2 DD1.1), Regulate Load (C9.2 DD2.1 DD2.3 DD2.5), Power (5 pins)
+12V: Step-Down converter (5 pins), Power (5 pins)
+A3.3V: Step-Down converter (C19.2 DA6.8), Regulate Load (C14.2 DA3.5 R6.2), Power (C34.2 C35.2 FB1.2 TP9.1)
+A12V: Regulate Load (C10.2 C13.2 DA2.8 DD2.14), Power (6 pins)
GND: NGI_Search_StepDown_lab (5 pins), Step-Down converter (16 pins), Regulated voltage input source (15 pins), Regulate Load (14 pins), Power (12 pins)
+24V_Protect: Regulated voltage input source (7 pins), Power (C26.2 DA9.1)
+Vdc_dc: NGI_Search_StepDown_lab (XP4.3), Step-Down converter (7 pins), Regulate Load (VT1.2)
+Vvar: Step-Down converter (VT2.2), Regulated voltage input source (8 pins)
IL: NGI_Search_StepDown_lab (XP4.1), Step-Down converter (DA6.7)
TIM1_CH1_PWM: NGI_Search_StepDown_lab (XP4.5), Step-Down converter (R14.1)

## Assembly variants
TWO I2C BUS: not fitted R48 R49
ONE I2C BUS: not fitted R46 R47